# Altium schematic sheet Display.SchDoc: Display Soldeerbout
size A4; DrawnBy: Mangelschots Emiel; SheetNumber: 1; SheetTotal: 4; Parameter 1: /; Parameter 2: 1EAID 12302093
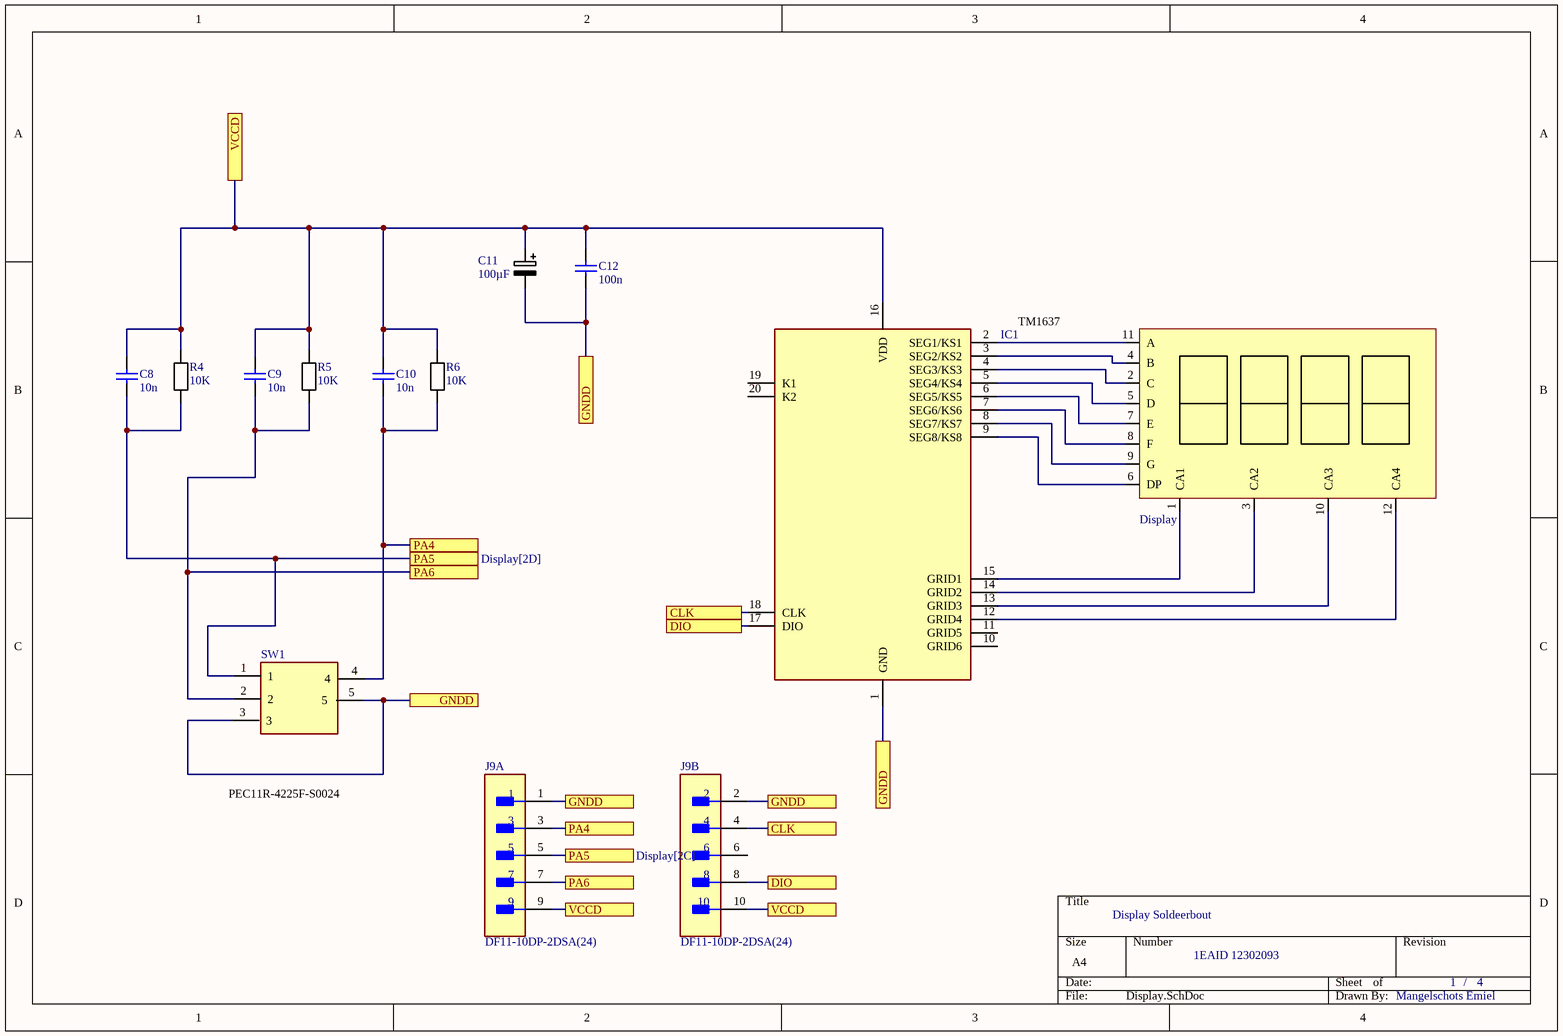
[diagram p0: Display.SchDoc]

## Parts
C8  10n  [CAPA]
C9  10n  [CAPA]
C10  10n  [CAPA]
C11  100µF  [CAPA1]
C12  100n  [CAPA]
IC8  IC1  [DIP778W43P254L2612H431Q20N]
J9  DF11-10DP-2DSA(24)  [FP-DF11-10DP-2DSA_24-MFG]  (parts A,B of 2)
KW4-801AVB  Display  [DISP]
R4  10K  [REST]
R5  10K  [REST]
R6  10K  [REST]
SW1  SW1  [SW1]  (value not drawn)

## Ports
CLK (see Display[2C]), CLK (see Display[2D]), DIO (see Display[2C]), DIO (see Display[2D]), GNDD (see Display[2B], Display[2C], Display[2D]), GNDD (see Display[2B], Display[2C], Display[2D], Display[3D]), GNDD (see Display[2B], Display[2D], Display[3D]), GNDD (see Display[2C], Display[2D], Display[3D]), PA4 (see Display[2C]), PA4 (see Display[2D]), PA5 (see Display[2C]), PA5 (see Display[2D]), PA6 (see Display[2C]), PA6 (see Display[2D]), VCCD (see Display[1A], Display[2D]), VCCD (see Display[2D])

## Nets
CLK: IC8.18(CLK) J9.4 ; port CLK
DIO: IC8.17(DIO) J9.8 ; port DIO
GNDD: C11.2 C12.1 IC8.1(GND) J9.1 J9.2 SW1.3 SW1.5 ; port GNDD
PA4: C10.1 J9.3 R6.1 SW1.4 ; port PA4
PA5: C8.1 J9.5 R4.1 SW1.1 ; port PA5
PA6: C9.1 J9.7 R5.1 SW1.2 ; port PA6
VCCD: C8.2 C9.2 C10.2 C11.1 C12.2 IC8.16(VDD) J9.9 J9.10 R4.2 R5.2 R6.2 ; port VCCD
NetIC8_2: IC8.2(SEG1/KS1) KW4-801AVB.11(A)
NetIC8_3: IC8.3(SEG2/KS2) KW4-801AVB.4(B)
NetIC8_4: IC8.4(SEG3/KS3) KW4-801AVB.2(C)
NetIC8_5: IC8.5(SEG4/KS4) KW4-801AVB.5(D)
NetIC8_6: IC8.6(SEG5/KS5) KW4-801AVB.7(E)
NetIC8_7: IC8.7(SEG6/KS6) KW4-801AVB.8(F)
NetIC8_8: IC8.8(SEG7/KS7) KW4-801AVB.9(G)
NetIC8_9: IC8.9(SEG8/KS8) KW4-801AVB.6(DP)
NetIC8_12: IC8.12(GRID4) KW4-801AVB.12(CA4)
NetIC8_13: IC8.13(GRID3) KW4-801AVB.10(CA3)
NetIC8_14: IC8.14(GRID2) KW4-801AVB.3(CA2)
NetIC8_15: IC8.15(GRID1) KW4-801AVB.1(CA1)

Not connected (* = marked no-connect by the designer): IC8 10(GRID6) 11(GRID5) 19(K1) 20(K2); J9 6

## Notes on the sheet
- (near IC8) TM1637
- PEC11R-4225F-S0024

## Library data of the parts
C8-C10 C12 = Capasitor: Part Number: GRM1885C1H100JA01D; Manufacturer: Murata
C11 = Capasitor_1: Part Number: GRM1885C1H100JA01D; Manufacturer: Murata
IC8 = IC1: TM1637
J9 = CMP-11610-000008-1: CONN HEADER VERT 10POS 2MM; Manufacturer: Hirose; Number Of Contacts: 10; Voltage Rating: 250V; Conn Orientation: Straight; Conn Gender: Male; Current Rating: 2A; Temperature Range High: +85°C; RoHS: TRUE; Device Class L2: Headers and Wire Housings; ComponentLink2URL: https://www.hirose.com/product/document?clcode=CL0543-0520-0-24&productname=DF11-10DP-2DSA(24)&series=DF11&documenttype=Catalog&lang=en&documentid=D31688_en; Height: 6.9mm; Package: DF11-10DP-2DSA(24); ComponentLink2Description: Datasheet; Automotive: No; Digikey Description: CONN HEADER VERT 10POS 2MM; Manufacturer Part Number: DF11-10DP-2DSA(24); Temperature: -40°C to +85°C; Octopart: https://octopart.com/df11-10dp-2dsa%2824%29-hirose-39521433; Number Of Rows: 2; Device Class L3: unset; Contact Material: Tin,Nickel; Mouser Description: Headers & Wire Housings 10P STRT HEADER THRU HL,BD MNT,SN; Category: Conn; Device Class L1: Connectors; Temperature Range Low: -40°C; Pitch: 2mm; Lead Free: Yes; Footprint Url: https://www.hirose.com/product/document?clcode=CL0543-0520-0-24&productname=DF11-10DP-2DSA(24)&series=DF11&documenttype=2DDrawing&lang=en&documentid=0000995333
KW4-801AVB = Display: KW4-801AVB
R4-R6 = resistor: Manufacturer: Vishay Dale; Part Number: CRCW08050000Z0EA
SW1 = SW1: PEC11R-4225F-S0024